# Altium schematic sheet OMD_LEDS_2_wire.SchDoc
size A2; DrawnBy: Philip Rowse
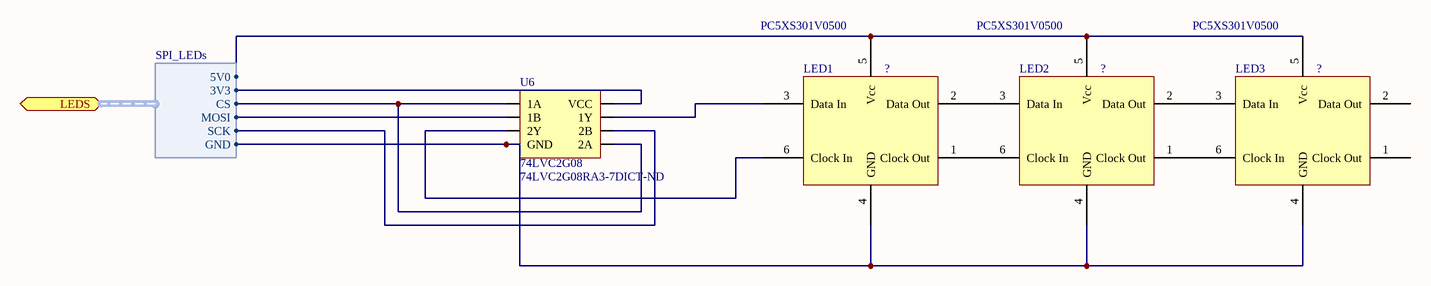
[diagram p0: OMD_LEDS_2_wire.SchDoc]

## Parts
LED1  ?  Supplier Part Number 1: PC5XS301V0500  [UBLED]
LED2  ?  Supplier Part Number 1: PC5XS301V0500  [UBLED]
LED3  ?  Supplier Part Number 1: PC5XS301V0500  [UBLED]
U6  74LVC2G08  Supplier Part Number 1: 74LVC2G08RA3-7DICT-ND  [SON50P100X40_HS-9L]

## Ports
LEDS (harness SPI_LEDs)

## Harnesses
SPI_LEDs: SCK, MOSI, CS, 3V3, 5V0, GND

## Nets
NetLED1_1: LED1.1(Clock_Out) LED2.6(Clock_In)
NetLED1_2: LED1.2(Data_Out) LED2.3(Data_In)
NetLED1_3: LED1.3(Data_In) U6.7(1Y)
NetLED1_4: LED1.4(GND) LED2.4(GND) LED3.4(GND) U6.4(GND) ; port LEDS.GND
NetLED1_5: LED1.5(Vcc) LED2.5(Vcc) LED3.5(Vcc) ; port LEDS.5V0
NetLED1_6: LED1.6(Clock_In) U6.3(2Y)
NetLED2_1: LED2.1(Clock_Out) LED3.6(Clock_In)
NetLED2_2: LED2.2(Data_Out) LED3.3(Data_In)
NetU6_1: U6.1(1A) U6.5(2A) ; port LEDS.CS
NetU6_2: U6.2(1B) ; port LEDS.MOSI
NetU6_6: U6.6(2B) ; port LEDS.SCK
NetU6_8: U6.8(VCC) ; port LEDS.3V3

Not connected (* = marked no-connect by the designer): LED3 1(Clock_Out) 2(Data_Out)

## Notes on the sheet
- Title
- Size:
- Date:
- File:
- A2
- Number:
- Time:
- Revision:
- Sheet
- of

## Library data of the parts
LED1-LED3 = UBLED: Supplier 1: jeff_chang@ubleds.com.tw; Supplier Unit Price 1: 0.2
U6 = 74LVC2G08: Supplier 1: Digi-Key